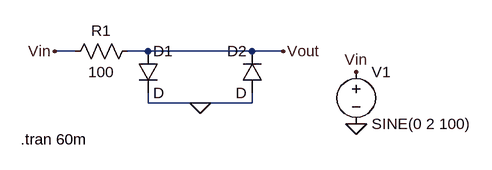
[diagram p0: schematic limiteur.asc]
limiteur.asc, the LTspice schematic file:
Version 4
SHEET 1 880 680
WIRE 64 128 32 128
WIRE 176 128 144 128
WIRE 336 128 176 128
WIRE 384 128 336 128
WIRE 176 208 176 192
WIRE 256 208 176 208
WIRE 336 208 336 192
WIRE 336 208 256 208
FLAG 256 208 0
FLAG 496 240 0
FLAG 496 160 Vin
FLAG 32 128 Vin
FLAG 384 128 Vout
SYMBOL diode 160 128 R0
SYMATTR InstName D1
SYMBOL diode 352 192 R180
WINDOW 0 24 64 Left 2
WINDOW 3 24 0 Left 2
SYMATTR InstName D2
SYMBOL res 160 112 R90
WINDOW 0 0 56 VBottom 2
WINDOW 3 32 56 VTop 2
SYMATTR InstName R1
SYMATTR Value 100
SYMBOL voltage 496 144 R0
WINDOW 123 0 0 Left 0
WINDOW 39 0 0 Left 0
SYMATTR InstName V1
SYMATTR Value SINE(0 2 100)
TEXT -20 264 Left 2 !.tran 60m

The netlist it stands for:
* limiteur.asc
D1 Vout 0 D
D2 0 Vout D
R1 Vout Vin 100
V1 Vin 0 SINE(0 2 100)
.model D D
.lib standard.dio
.tran 60m
.backanno
.end